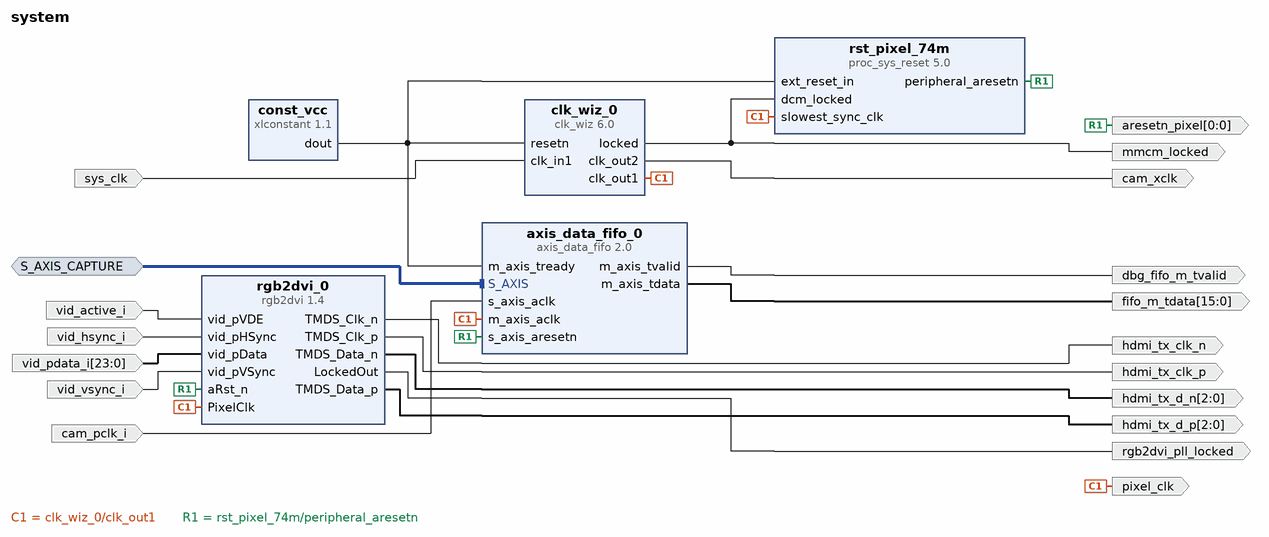
[diagram p0: block diagram of the top level]
# Vivado block design system, xc7z020clg400-1, Vivado 2025.2
create_bd_design system

create_bd_intf_port -mode Slave -vlnv xilinx.com:interface:axis_rtl:1.0 S_AXIS_CAPTURE
set_property -dict [list \
  CONFIG.FREQ_HZ 24390000 \
  CONFIG.HAS_TKEEP 0 \
  CONFIG.HAS_TLAST 1 \
  CONFIG.HAS_TREADY 1 \
  CONFIG.HAS_TSTRB 0 \
  CONFIG.LAYERED_METADATA undef \
  CONFIG.TDATA_NUM_BYTES 2 \
  CONFIG.TDEST_WIDTH 0 \
  CONFIG.TID_WIDTH 0 \
  CONFIG.TUSER_WIDTH 0 \
] [get_bd_intf_ports S_AXIS_CAPTURE]
create_bd_port -dir I -type clk sys_clk
set_property -dict {CONFIG.FREQ_HZ 125000000} [get_bd_ports sys_clk]
create_bd_port -dir O hdmi_tx_clk_p
create_bd_port -dir O hdmi_tx_clk_n
create_bd_port -dir O -from 2 -to 0 hdmi_tx_d_p
create_bd_port -dir O -from 2 -to 0 hdmi_tx_d_n
create_bd_port -dir O cam_xclk
create_bd_port -dir I -type clk cam_pclk_i
set_property -dict {CONFIG.FREQ_HZ 24390000} [get_bd_ports cam_pclk_i]
create_bd_port -dir O -type clk pixel_clk
create_bd_port -dir O mmcm_locked
create_bd_port -dir O -from 0 -to 0 aresetn_pixel
create_bd_port -dir O rgb2dvi_pll_locked
create_bd_port -dir O dbg_fifo_m_tvalid
create_bd_port -dir O -from 15 -to 0 fifo_m_tdata
create_bd_port -dir I vid_hsync_i
create_bd_port -dir I vid_vsync_i
create_bd_port -dir I vid_active_i
create_bd_port -dir I -from 23 -to 0 vid_pdata_i

create_bd_cell -type ip -vlnv xilinx.com:ip:clk_wiz:6.0 clk_wiz_0
set_property -dict [list \
  CONFIG.CLKOUT1_REQUESTED_OUT_FREQ 74.250 \
  CONFIG.CLKOUT1_USED true \
  CONFIG.CLKOUT2_REQUESTED_OUT_FREQ 24.390 \
  CONFIG.CLKOUT2_USED true \
  CONFIG.PRIM_IN_FREQ 125.000 \
  CONFIG.PRIM_SOURCE Single_ended_clock_capable_pin \
  CONFIG.RESET_TYPE ACTIVE_LOW \
  CONFIG.USE_LOCKED true \
  CONFIG.USE_RESET true \
] [get_bd_cells clk_wiz_0]
create_bd_cell -type ip -vlnv xilinx.com:ip:proc_sys_reset:5.0 rst_pixel_74m
create_bd_cell -type ip -vlnv xilinx.com:ip:axis_data_fifo:2.0 axis_data_fifo_0
set_property -dict [list \
  CONFIG.FIFO_DEPTH 4096 \
  CONFIG.HAS_TLAST 1 \
  CONFIG.IS_ACLK_ASYNC 1 \
  CONFIG.TDATA_NUM_BYTES 2 \
  CONFIG.TUSER_WIDTH 1 \
] [get_bd_cells axis_data_fifo_0]
create_bd_cell -type ip -vlnv digilentinc.com:ip:rgb2dvi:1.4 rgb2dvi_0
set_property -dict [list \
  CONFIG.kClkPrimitive PLL \
  CONFIG.kClkRange 2 \
  CONFIG.kGenerateSerialClk true \
  CONFIG.kRstActiveHigh false \
] [get_bd_cells rgb2dvi_0]
create_bd_cell -type ip -vlnv xilinx.com:ip:xlconstant:1.1 const_vcc
set_property -dict {CONFIG.CONST_VAL 1} [get_bd_cells const_vcc]

# ---- connections ----

connect_bd_intf_net [get_bd_intf_ports S_AXIS_CAPTURE] [get_bd_intf_pins axis_data_fifo_0/S_AXIS]
connect_bd_net [get_bd_pins axis_data_fifo_0/m_axis_tdata] [get_bd_ports fifo_m_tdata]
connect_bd_net [get_bd_pins axis_data_fifo_0/m_axis_tvalid] [get_bd_ports dbg_fifo_m_tvalid]
connect_bd_net [get_bd_ports cam_pclk_i] [get_bd_pins axis_data_fifo_0/s_axis_aclk]
connect_bd_net [get_bd_pins clk_wiz_0/clk_out1] \
  [get_bd_pins rgb2dvi_0/PixelClk] [get_bd_pins rst_pixel_74m/slowest_sync_clk] [get_bd_pins axis_data_fifo_0/m_axis_aclk] \
  [get_bd_ports pixel_clk]
connect_bd_net [get_bd_pins clk_wiz_0/clk_out2] [get_bd_ports cam_xclk]
connect_bd_net [get_bd_pins clk_wiz_0/locked] [get_bd_pins rst_pixel_74m/dcm_locked] [get_bd_ports mmcm_locked]
connect_bd_net [get_bd_pins const_vcc/dout] \
  [get_bd_pins clk_wiz_0/resetn] [get_bd_pins rst_pixel_74m/ext_reset_in] [get_bd_pins axis_data_fifo_0/m_axis_tready]
connect_bd_net [get_bd_pins rgb2dvi_0/LockedOut] [get_bd_ports rgb2dvi_pll_locked]
connect_bd_net [get_bd_pins rgb2dvi_0/TMDS_Clk_n] [get_bd_ports hdmi_tx_clk_n]
connect_bd_net [get_bd_pins rgb2dvi_0/TMDS_Clk_p] [get_bd_ports hdmi_tx_clk_p]
connect_bd_net [get_bd_pins rgb2dvi_0/TMDS_Data_n] [get_bd_ports hdmi_tx_d_n]
connect_bd_net [get_bd_pins rgb2dvi_0/TMDS_Data_p] [get_bd_ports hdmi_tx_d_p]
connect_bd_net [get_bd_pins rst_pixel_74m/peripheral_aresetn] \
  [get_bd_pins rgb2dvi_0/aRst_n] [get_bd_pins axis_data_fifo_0/s_axis_aresetn] [get_bd_ports aresetn_pixel]
connect_bd_net [get_bd_ports sys_clk] [get_bd_pins clk_wiz_0/clk_in1]
connect_bd_net [get_bd_ports vid_active_i] [get_bd_pins rgb2dvi_0/vid_pVDE]
connect_bd_net [get_bd_ports vid_hsync_i] [get_bd_pins rgb2dvi_0/vid_pHSync]
connect_bd_net [get_bd_ports vid_pdata_i] [get_bd_pins rgb2dvi_0/vid_pData]
connect_bd_net [get_bd_ports vid_vsync_i] [get_bd_pins rgb2dvi_0/vid_pVSync]

validate_bd_design
save_bd_design
